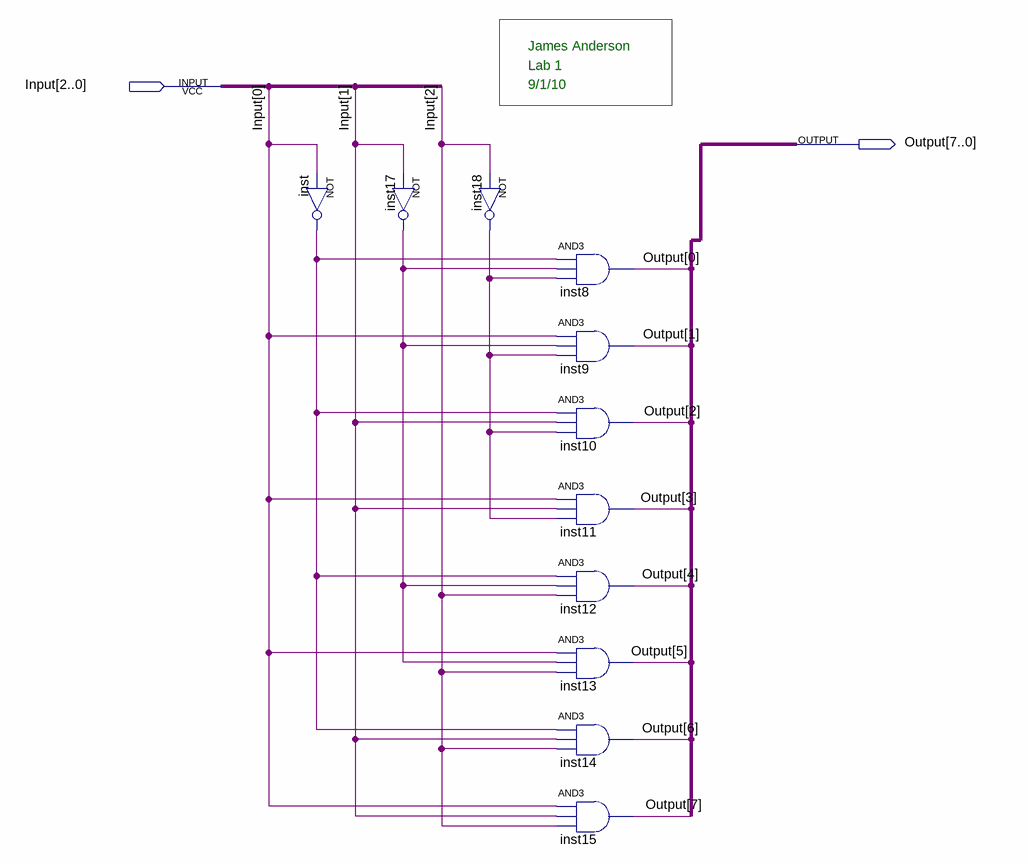
[diagram p0: schematic sheet]
// Quartus schematic 3_8dec.bdf as structural Verilog: 11 symbols, 2 pins
module \3_8dec  (
  input  [2:0] Input,
  output [7:0] Output
);

  wire inst17_out, inst18_out, inst_out;

  not inst (inst_out, Input[0]);
  not inst17 (inst17_out, Input[1]);
  not inst18 (inst18_out, Input[2]);
  and inst8 (Output[0], inst_out, inst17_out, inst18_out);
  and inst9 (Output[1], Input[0], inst17_out, inst18_out);
  and inst10 (Output[2], inst_out, Input[1], inst18_out);
  and inst11 (Output[3], Input[0], Input[1], inst18_out);
  and inst12 (Output[4], inst_out, inst17_out, Input[2]);
  and inst13 (Output[5], Input[0], inst17_out, Input[2]);
  and inst14 (Output[6], inst_out, Input[1], Input[2]);
  and inst15 (Output[7], Input[0], Input[1], Input[2]);

  // Notes on the sheet:
  //   James Anderson
  //   Lab 1
  //   9/1/10
endmodule
